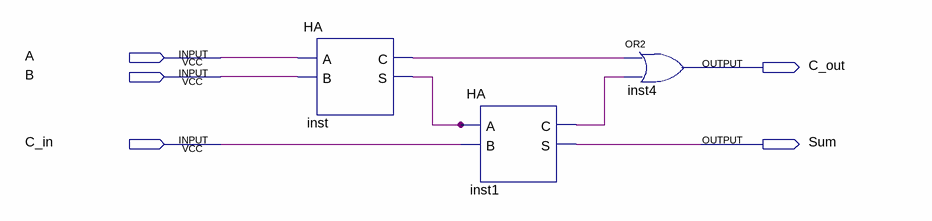
[diagram p0: schematic sheet]
// Quartus schematic FA.bdf as structural Verilog: 3 symbols, 5 pins
module FA (
  input  A,
  input  B,
  input  C_in,
  output C_out,
  output Sum
);

  wire inst1_c, inst_c, inst_s;

  HA inst (.A(A), .B(B), .C(inst_c), .S(inst_s));
  HA inst1 (.A(inst_s), .B(C_in), .C(inst1_c), .S(Sum));
  or inst4 (C_out, inst_c, inst1_c);
endmodule
